# Altium schematic sheet Power.SchDoc
size A3
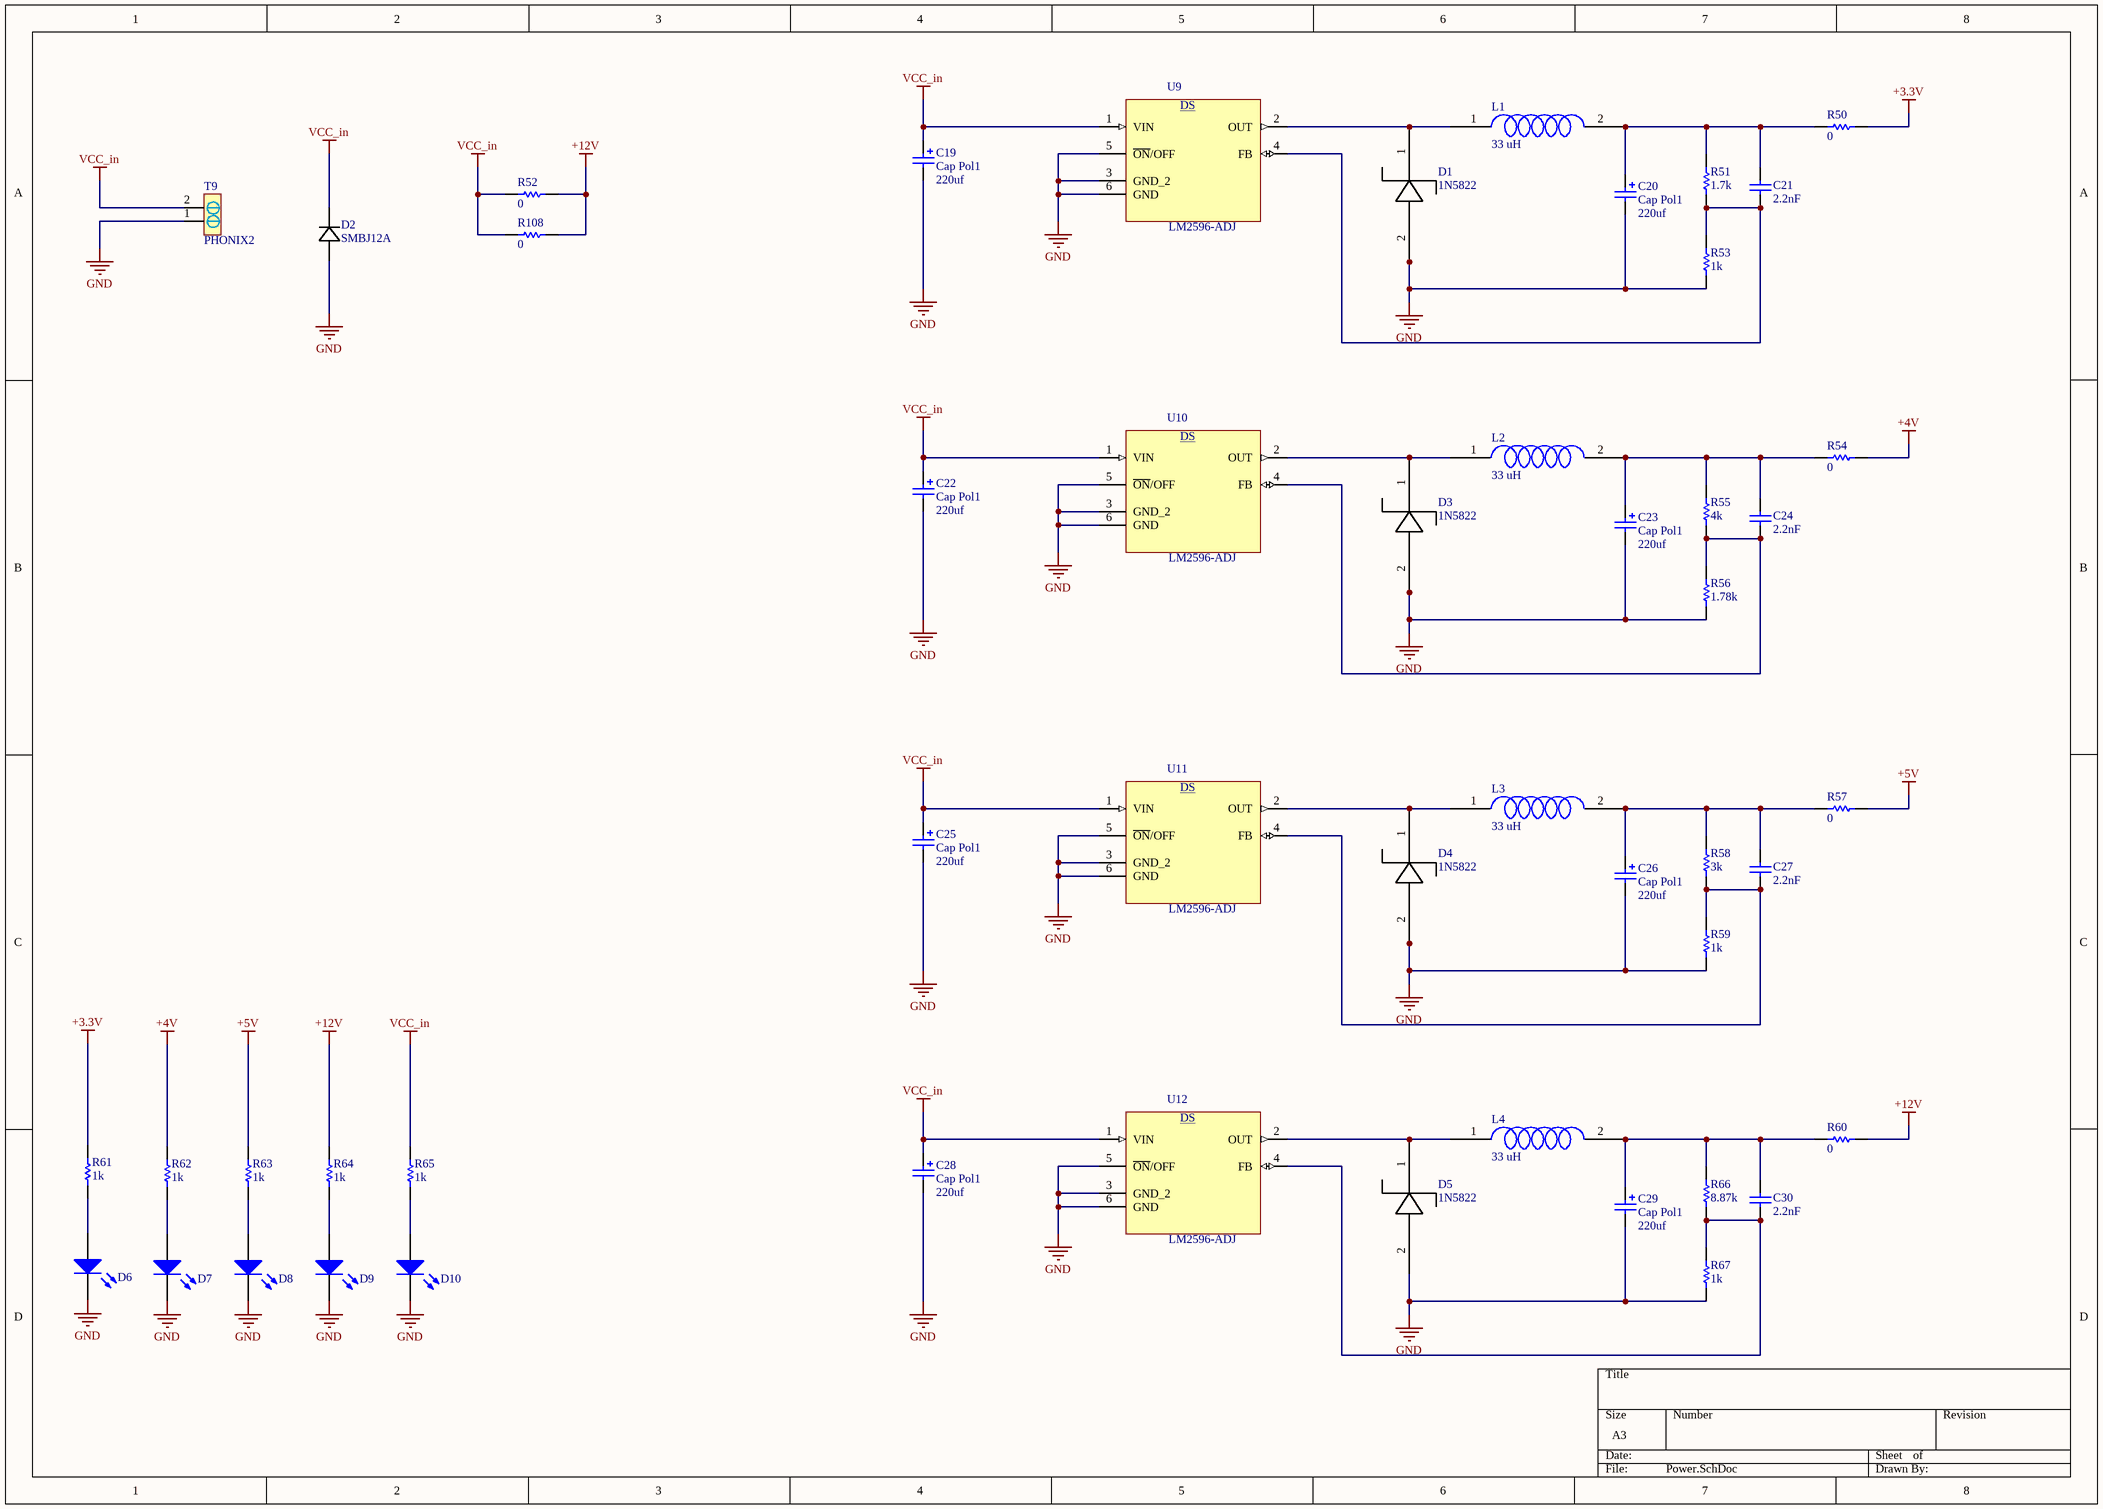
[diagram p0: Power.SchDoc]

## Parts
C19  Cap Pol1  value 220uf  [RB5-10.5]
C20  Cap Pol1  value 220uf  [RB5-10.5]
C21  value 2.2nF  [C-805]  (hidden comment: C-805)
C22  Cap Pol1  value 220uf  [RB5-10.5]
C23  Cap Pol1  value 220uf  [RB5-10.5]
C24  value 2.2nF  [C-805]  (hidden comment: C-805)
C25  Cap Pol1  value 220uf  [RB5-10.5]
C26  Cap Pol1  value 220uf  [RB5-10.5]
C27  value 2.2nF  [C-805]  (hidden comment: C-805)
C28  Cap Pol1  value 220uf  [RB5-10.5]
C29  Cap Pol1  value 220uf  [RB5-10.5]
C30  value 2.2nF  [C-805]  (hidden comment: C-805)
D1  1N5822  [1N5822]
D2  SMBJ12A  [SMB]
D3  1N5822  [1N5822]
D4  1N5822  [1N5822]
D5  1N5822  [1N5822]
D6  LED  [LED-805]  (value not drawn)
D7  LED  [LED-805]  (value not drawn)
D8  LED  [LED-805]  (value not drawn)
D9  LED  [LED-805]  (value not drawn)
D10  LED  [LED-805]  (value not drawn)
L1  33 uH  [Inductor]
L2  33 uH  [Inductor]
L3  33 uH  [Inductor]
L4  33 uH  [Inductor]
R50  value 0  [R-1206]  (hidden comment: R-1206)
R51  value 1.7k  [R-805]  (hidden comment: R-805)
R52  value 0  [R-1206]  (hidden comment: R-1206)
R53  value 1k  [R-805]  (hidden comment: R-805)
R54  value 0  [R-1206]  (hidden comment: R-1206)
R55  value 4k  [R-805]  (hidden comment: R-805)
R56  value 1.78k  [R-805]  (hidden comment: R-805)
R57  value 0  [R-1206]  (hidden comment: R-1206)
R58  value 3k  [R-805]  (hidden comment: R-805)
R59  value 1k  [R-805]  (hidden comment: R-805)
R60  value 0  [R-1206]  (hidden comment: R-1206)
R61  value 1k  [R-805]  (hidden comment: R-805)
R62  value 1k  [R-805]  (hidden comment: R-805)
R63  value 1k  [R-805]  (hidden comment: R-805)
R64  value 1k  [R-805]  (hidden comment: R-805)
R65  value 1k  [R-805]  (hidden comment: R-805)
R66  value 8.87k  [R-805]  (hidden comment: R-805)
R67  value 1k  [R-805]  (hidden comment: R-805)
R108  value 0  [R-1206]  (hidden comment: R-1206)
T9  PHONIX2  [PHONIX2]
U9  LM2596-ADJ  [LM2596SX]
U10  LM2596-ADJ  [LM2596SX]
U11  LM2596-ADJ  [LM2596SX]
U12  LM2596-ADJ  [LM2596SX]

## Nets
+3.3V: R50.2 R61.2
+4V: R54.2 R62.2
+5V: R57.2 R63.2
+12V: R52.2 R60.2 R64.2 R108.2
GND: C19.2 C20.2 C22.2 C23.2 C25.2 C26.2 C28.2 C29.2 D1.2 D2.2 D3.2 D4.2 D5.2 D6.2(K) D7.2(K) D8.2(K) D9.2(K) D10.2(K) R53.2 R56.2 R59.2 R67.2 T9.1 U9.3(GND_2) U9.5(~{ON}/OFF) U9.6(GND) U10.3(GND_2) U10.5(~{ON}/OFF) U10.6(GND) U11.3(GND_2) U11.5(~{ON}/OFF) U11.6(GND) U12.3(GND_2) U12.5(~{ON}/OFF) U12.6(GND)
VCC_in: C19.1 C22.1 C25.1 C28.1 D2.1 R52.1 R65.2 R108.1 T9.2 U9.1(VIN) U10.1(VIN) U11.1(VIN) U12.1(VIN)
NetC20_1: C20.1 C21.2 L1.2 R50.1 R51.1
NetC21_1: C21.1 R51.2 R53.1 U9.4(FB)
NetC23_1: C23.1 C24.2 L2.2 R54.1 R55.1
NetC24_1: C24.1 R55.2 R56.1 U10.4(FB)
NetC26_1: C26.1 C27.2 L3.2 R57.1 R58.1
NetC27_1: C27.1 R58.2 R59.1 U11.4(FB)
NetC29_1: C29.1 C30.2 L4.2 R60.1 R66.1
NetC30_1: C30.1 R66.2 R67.1 U12.4(FB)
NetD1_1: D1.1 L1.1 U9.2(OUT)
NetD3_1: D3.1 L2.1 U10.2(OUT)
NetD4_1: D4.1 L3.1 U11.2(OUT)
NetD5_1: D5.1 L4.1 U12.2(OUT)
NetD6_1: D6.1(A) R61.1
NetD7_1: D7.1(A) R62.1
NetD8_1: D8.1(A) R63.1
NetD9_1: D9.1(A) R64.1
NetD10_1: D10.1(A) R65.1

## Notes on the sheet
- (in symbol LM2596-ADJ) DS

## Library data of the parts
C19 C20 C22 C23 C25 C26 C28 C29 = Cap Pol1: Polarized Capacitor (Radial); Published: 8-Jun-2000; LatestRevisionDate: 17-Jul-2002; LatestRevisionNote: Re-released for DXP Platform.; PackageReference: RB7.6-15; Publisher: Altium Limited; PackageDescription: Polarized Capacitor (Radial); 2 Leads
C21 C24 C27 C30 = C-805: Capacitor; Published: 8-Jun-2000; LatestRevisionDate: 29-May-2009; LatestRevisionNote: IPC-7351 Footprint Added.; PackageReference: C1206; Publisher: Altium Limited; PackageDescription: Chip Capacitor
D2 = SMBJ12A: No Description Available; Manufacturer_Part_Number: SMBJ12A-13-F; Vendor: Diodes Inc; Built_By: EMA_UL_Team; Type: DEV; Copyright: Copyright (C) 2018 Accelerated Designs. All rights reserved; RefDes: RefDes; Value: Value
D6-D10 = LED-805: LED Size 805; Published: 8-Jun-2000; LatestRevisionDate: 17-Jul-2002; LatestRevisionNote: Re-released for DXP Platform.; PackageVersion: Feb-2002; PackageReference: 3.2X1.6X1.1; Publisher: Altium Limited; PackageDescription: SM LED; 2 Flat Leads
L1-L4 = Inductor: Power inductor
R50 R52 R54 R57 R60 R108 = R-1206: Resistor
R51 R53 R55 R56 R58 R59 R61-R67 = R-805: Resistor
U9-U12 = LM2596-ADJ: SIMPLE SWITCHER Power Converter 150 KHz 3A Step-Down Voltage Regulator 5-DDPAK/TO-263; MF: Texas Instruments; MP: LM2596-ADJ; Package: TO-263-6 Texas Instruments; SnapEDA_Link: https://www.snapeda.com/parts/LM2596SX-12/Texas%20Instruments/view-part/?ref=snap; Price: 1.83 USD; Availability: Unavailable; Value: *